# Altium schematic sheet NP_aktivni_standard_Sallen_Key.SchDoc
size A4
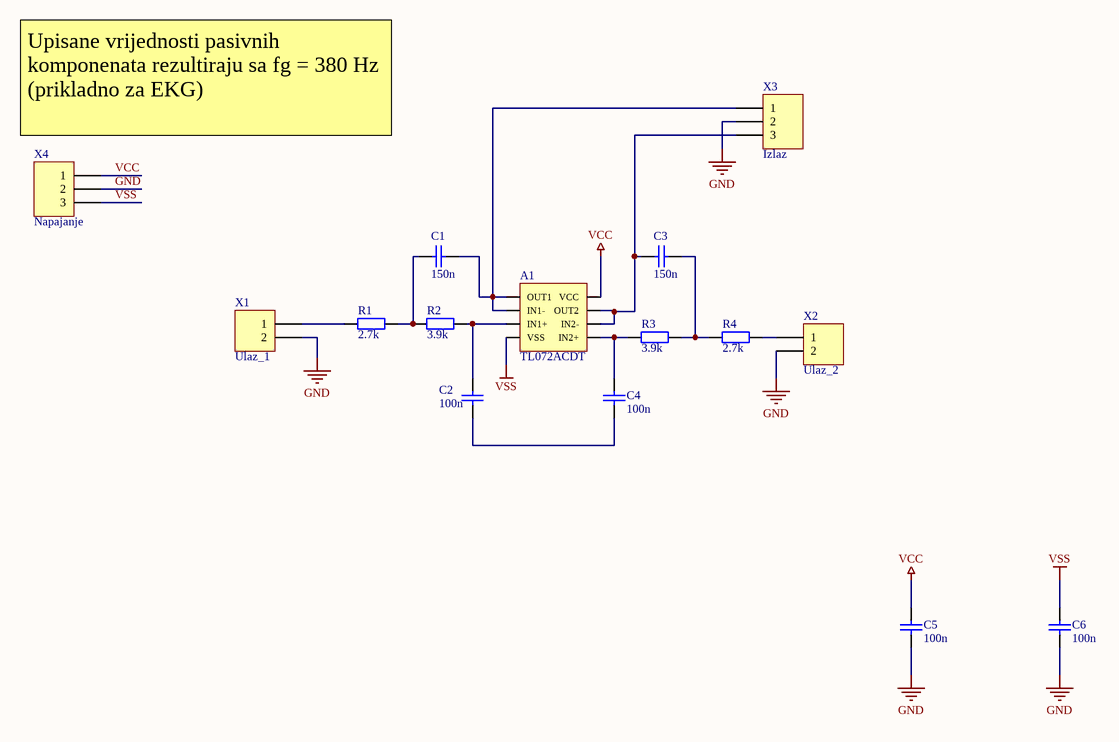
[diagram p0: NP_aktivni_standard_Sallen_Key.SchDoc]

## Parts
A1  TL072ACDT  [ADI-R-8_N]
C1  150n  [J1-0603]
C2  100n  [J1-0603]
C3  150n  [J1-0603]
C4  100n  [J1-0603]
C5  100n  [J1-0603]
C6  100n  [J1-0603]
R1  2.7k  [J1-0603]
R2  3.9k  [J1-0603]
R3  3.9k  [J1-0603]
R4  2.7k  [J1-0603]
X1  Ulaz_1  [HDR1X2]
X2  Ulaz_2  [HDR1X2]
X3  Izlaz  [HDR1X3]
X4  Napajanje  [HDR1X3]

## Nets
GND: C5.1 C6.1 X1.2 X2.2 X3.2 X4.2
VCC: A1.8(VCC) C5.2 X4.1
VSS: A1.4(VSS) C6.2 X4.3
NetA1_1: A1.1(OUT1) A1.2(IN1-) C1.2 X3.1
NetA1_3: A1.3(IN1+) C2.2 R2.2
NetA1_5: A1.5(IN2+) C4.1 R3.1
NetA1_6: A1.6(IN2-) A1.7(OUT2) C3.2 X3.3
NetC1_1: C1.1 R1.2 R2.1
NetC2_1: C2.1 C4.2
NetC3_1: C3.1 R3.2 R4.1
NetR1_1: R1.1 X1.1
NetR4_2: R4.2 X2.1

## Notes on the sheet
- (near X4) Upisane vrijednosti pasivnih komponenata rezultiraju sa fg = 380 Hz (prikladno za EKG)

## Library data of the parts
A1 = TL072ACDT: Dual opamp
C1-C6 = Cap: Capacitor; Value: 100pF; Published: 8-Jun-2000; LatestRevisionDate: 17-Jul-2002; LatestRevisionNote: Re-released for DXP Platform.; PackageReference: RAD-0.3; Publisher: Altium Limited; PackageDescription: Radial Cap, Thru-Hole; 2 Leads; 0.3 in Pin Spacing
R1-R4 = Res2: Resistor; Value: 1K; Published: 8-Jun-2000; LatestRevisionDate: 17-Jul-2002; LatestRevisionNote: Re-released for DXP Platform.; PackageReference: AXIAL-0.4; Publisher: Altium Limited; PackageDescription: Axial Device, Thru-Hole; 2 Leads; 0.4 in Pin Spacing
X1 X2 = Header 2: Header, 2-Pin; LatestRevisionDate: 17-Jul-2002; LatestRevisionNote: Re-released for DXP Platform.; Publisher: Altium Limited
X3 X4 = Header 3: Header, 3-Pin; LatestRevisionDate: 17-Jul-2002; LatestRevisionNote: Re-released for DXP Platform.; Publisher: Altium Limited